# Altium schematic sheet Sheet4.SchDoc
size A3
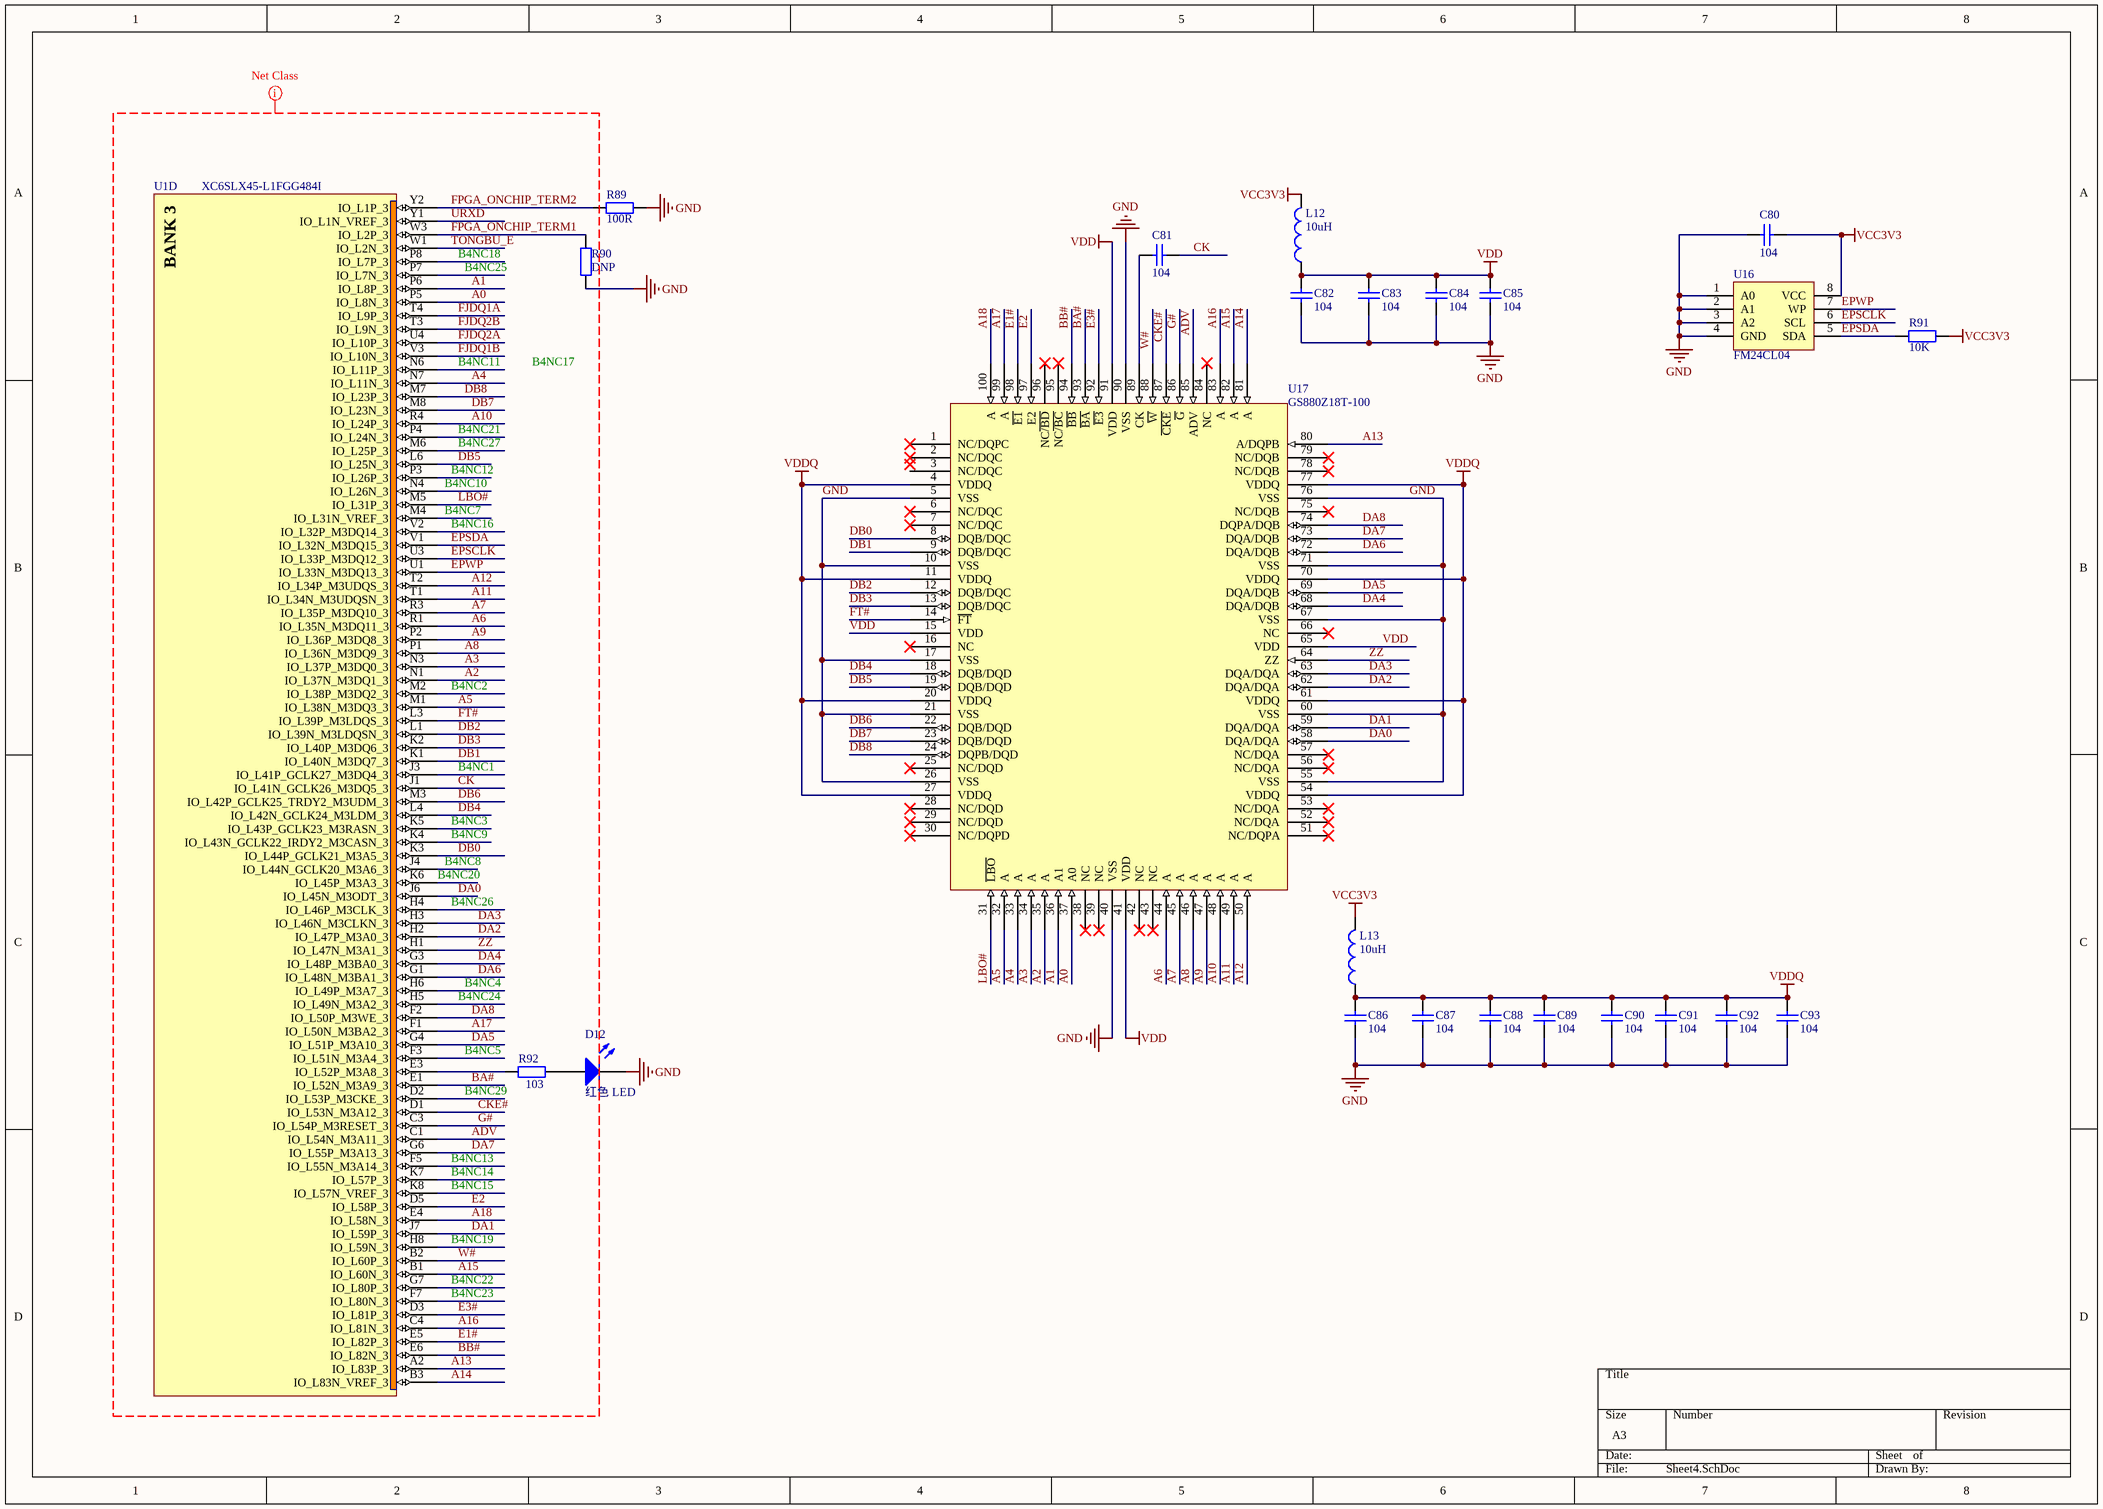
[diagram p0: Sheet4.SchDoc]

## Parts
C80  104  [0402]
C81  104  [0402]
C82  104  [0402]
C83  104  [0402]
C84  104  [0402]
C85  104  [0402]
C86  104  [0402]
C87  104  [0402]
C88  104  [0402]
C89  104  [0402]
C90  104  [0402]
C91  104  [0402]
C92  104  [0402]
C93  104  [0402]
D12  红色 LED  [0805LED]
L12  10uH  [1206A]
L13  10uH  [1206A]
R89  100R  [0603]
R90  DNP  [0603]
R91  10K  [0603]
R92  103  [0603]
U1  XC6SLX45-L1FGG484I  [FGG484]  (part D of 8)
U16  FM24CL04  [so_8]
U17  GS880Z18T-100  [QFP65P1680X2280-100N]

## Nets
GND: C80.2 C82.1 C83.1 C84.1 C85.1 C86.1 C87.1 C88.1 C89.1 C90.1 C91.1 C92.1 C93.1 D12.2(K) R89.2 R90.2 U16.1(A0) U16.2(A1) U16.3(A2) U16.4(GND) U17.5(VSS) U17.10(VSS) U17.17(VSS) U17.21(VSS) U17.26(VSS) U17.40(VSS) U17.55(VSS) U17.60(VSS) U17.67(VSS) U17.71(VSS) U17.76(VSS) U17.90(VSS)
VCC3V3: C80.1 L12.2 L13.2 R91.2 U16.8(VCC)
VDD: C82.2 C83.2 C84.2 C85.2 L12.1 U17.15(VDD) U17.41(VDD) U17.65(VDD) U17.91(VDD)
VDDQ: C86.2 C87.2 C88.2 C89.2 C90.2 C91.2 C92.2 C93.2 L13.1 U17.4(VDDQ) U17.11(VDDQ) U17.20(VDDQ) U17.27(VDDQ) U17.54(VDDQ) U17.61(VDDQ) U17.70(VDDQ) U17.77(VDDQ)
A0: U1.P5(IO_L8N_3) U17.37(A0)
A1: U1.P6(IO_L8P_3) U17.36(A1)
A2: U1.N1(IO_L37N_M3DQ1_3) U17.35(A)
A3: U1.N3(IO_L37P_M3DQ0_3) U17.34(A)
A4: U1.N7(IO_L11N_3) U17.33(A)
A5: U1.M1(IO_L38N_M3DQ3_3) U17.32(A)
A6: U1.R1(IO_L35N_M3DQ11_3) U17.44(A)
A7: U1.R3(IO_L35P_M3DQ10_3) U17.45(A)
A8: U1.P1(IO_L36N_M3DQ9_3) U17.46(A)
A9: U1.P2(IO_L36P_M3DQ8_3) U17.47(A)
A10: U1.R4(IO_L24P_3) U17.48(A)
A11: U1.T1(IO_L34N_M3UDQSN_3) U17.49(A)
A12: U1.T2(IO_L34P_M3UDQS_3) U17.50(A)
A13: U1.A2(IO_L83P_3) U17.80(A/DQPB)
A14: U1.B3(IO_L83N_VREF_3) U17.81(A)
A15: U1.B1(IO_L60N_3) U17.82(A)
A16: U1.C4(IO_L81N_3) U17.83(A)
A17: U1.F1(IO_L50N_M3BA2_3) U17.99(A)
A18: U1.E4(IO_L58N_3) U17.100(A)
ADV: U1.C1(IO_L54N_M3A11_3) U17.85(ADV)
B4NC1: U1.J3(IO_L41P_GCLK27_M3DQ4_3)
B4NC2: U1.M2(IO_L38P_M3DQ2_3)
B4NC3: U1.K5(IO_L43P_GCLK23_M3RASN_3)
B4NC4: U1.H6(IO_L49P_M3A7_3)
B4NC5: U1.F3(IO_L51N_M3A4_3)
B4NC7: U1.M4(IO_L31N_VREF_3)
B4NC8: U1.J4(IO_L44N_GCLK20_M3A6_3)
B4NC9: U1.K4(IO_L43N_GCLK22_IRDY2_M3CASN_3)
B4NC10: U1.N4(IO_L26N_3)
B4NC11: U1.N6(IO_L11P_3)
B4NC12: U1.P3(IO_L26P_3)
B4NC13: U1.F5(IO_L55N_M3A14_3)
B4NC14: U1.K7(IO_L57P_3)
B4NC15: U1.K8(IO_L57N_VREF_3)
B4NC16: U1.V2(IO_L32P_M3DQ14_3)
B4NC18: U1.P8(IO_L7P_3)
B4NC19: U1.H8(IO_L59N_3)
B4NC20: U1.K6(IO_L45P_M3A3_3)
B4NC21: U1.P4(IO_L24N_3)
B4NC22: U1.G7(IO_L80P_3)
B4NC23: U1.F7(IO_L80N_3)
B4NC24: U1.H5(IO_L49N_M3A2_3)
B4NC25: U1.P7(IO_L7N_3)
B4NC26: U1.H4(IO_L46P_M3CLK_3)
B4NC27: U1.M6(IO_L25P_3)
B4NC29: U1.D2(IO_L53P_M3CKE_3)
BA#: U1.E1(IO_L52N_M3A9_3) U17.93(~{BA})
BB#: U1.E6(IO_L82N_3) U17.94(~{BB})
CK: C81.1 U1.J1(IO_L41N_GCLK26_M3DQ5_3)
CKE#: U1.D1(IO_L53N_M3A12_3) U17.87(~{CKE})
DA0: U1.J6(IO_L45N_M3ODT_3) U17.58(DQA/DQA)
DA1: U1.J7(IO_L59P_3) U17.59(DQA/DQA)
DA2: U1.H2(IO_L47P_M3A0_3) U17.62(DQA/DQA)
DA3: U1.H3(IO_L46N_M3CLKN_3) U17.63(DQA/DQA)
DA4: U1.G3(IO_L48P_M3BA0_3) U17.68(DQA/DQB)
DA5: U1.G4(IO_L51P_M3A10_3) U17.69(DQA/DQB)
DA6: U1.G1(IO_L48N_M3BA1_3) U17.72(DQA/DQB)
DA7: U1.G6(IO_L55P_M3A13_3) U17.73(DQA/DQB)
DA8: U1.F2(IO_L50P_M3WE_3) U17.74(DQPA/DQB)
DB0: U1.K3(IO_L44P_GCLK21_M3A5_3) U17.8(DQB/DQC)
DB1: U1.K1(IO_L40N_M3DQ7_3) U17.9(DQB/DQC)
DB2: U1.L1(IO_L39N_M3LDQSN_3) U17.12(DQB/DQC)
DB3: U1.K2(IO_L40P_M3DQ6_3) U17.13(DQB/DQC)
DB4: U1.L4(IO_L42N_GCLK24_M3LDM_3) U17.18(DQB/DQD)
DB5: U1.L6(IO_L25N_3) U17.19(DQB/DQD)
DB6: U1.M3(IO_L42P_GCLK25_TRDY2_M3UDM_3) U17.22(DQB/DQD)
DB7: U1.M8(IO_L23N_3) U17.23(DQB/DQD)
DB8: U1.M7(IO_L23P_3) U17.24(DQPB/DQD)
E1#: U1.E5(IO_L82P_3) U17.98(~{E1})
E2: U1.D5(IO_L58P_3) U17.97(E2)
E3#: U1.D3(IO_L81P_3) U17.92(~{E3})
EPSCLK: U1.U3(IO_L33P_M3DQ12_3) U16.6(SCL)
EPSDA: R91.1 U1.V1(IO_L32N_M3DQ15_3) U16.5(SDA)
EPWP: U1.U1(IO_L33N_M3DQ13_3) U16.7(WP)
FJDQ1A: U1.T4(IO_L9P_3)
FJDQ1B: U1.V3(IO_L10N_3)
FJDQ2A: U1.U4(IO_L10P_3)
FJDQ2B: U1.T3(IO_L9N_3)
FPGA_ONCHIP_TERM1: R90.1 U1.W3(IO_L2P_3)
FPGA_ONCHIP_TERM2: R89.1 U1.Y2(IO_L1P_3)
FT#: U1.L3(IO_L39P_M3LDQS_3) U17.14(~{FT})
G#: U1.C3(IO_L54P_M3RESET_3) U17.86(~{G})
LBO#: U1.M5(IO_L31P_3) U17.31(~{LBO})
TONGBU_E: U1.W1(IO_L2N_3)
URXD: U1.Y1(IO_L1N_VREF_3)
W#: U1.B2(IO_L60P_3) U17.88(~{W})
ZZ: U1.H1(IO_L47N_M3A1_3) U17.64(ZZ)
NetC81_2: C81.2 U17.89(CK)
NetD12_1: D12.1(A) R92.2
NetR92_1: R92.1 U1.E3(IO_L52P_M3A8_3)

Not connected (* = marked no-connect by the designer): U17 1(NC/DQPC)* 2(NC/DQC)* 3(NC/DQC) 6(NC/DQC)* 7(NC/DQC)* 16(NC)* 25(NC/DQD)* 28(NC/DQD)* 29(NC/DQD)* 30(NC/DQPD)* 38(NC)* 39(NC)* 42(NC)* 43(NC)* 51(NC/DQPA)* 52(NC/DQA)* 53(NC/DQA)* 56(NC/DQA)* 57(NC/DQA)* 66(NC)* 75(NC/DQB)* 78(NC/DQB)* 79(NC/DQB)* 84(NC)* 95(NC~{/BC})* 96(NC~{/BD})*

## Layout directives
net class BNAK3: A0, A1, A2, A3, A4, A5, A6, A7, A8, A9, A10, A11, A12, A13, A14, A15, A16, A17, A18, ADV, B4NC1, B4NC2, B4NC3, B4NC4, B4NC5, B4NC7, B4NC8, B4NC9, B4NC10, B4NC11, B4NC12, B4NC13, B4NC14, B4NC15, B4NC16, B4NC17, B4NC18, B4NC19, B4NC20, B4NC21, B4NC22, B4NC23, B4NC24, B4NC25, B4NC26, B4NC27, B4NC29, BA#, BB#, CK, CKE#, DA0, DA1, DA2, DA3, DA4, DA5, DA6, DA7, DA8, DB0, DB1, DB2, DB3, DB4, DB5, DB6, DB7, DB8, E1#, E2, E3#, EPSCLK, EPSDA, EPWP, FJDQ1A, FJDQ1B, FJDQ2A, FJDQ2B, FPGA_ONCHIP_TERM1, FPGA_ONCHIP_TERM2, FT#, G#, LBO#, TONGBU_E, URXD, W#, ZZ

## Notes on the sheet
- Labels drawn without touching a wire or pin: B4NC17
- (in symbol XC6SLX45-L1FGG484I, part D) BANK 3

## Library data of the parts
C80-C93 = Cap: Capacitor; Published: 8-Jun-2000; LatestRevisionDate: 17-Jul-2002; LatestRevisionNote: Re-released for DXP Platform.; Publisher: Altium Limited; Value: 104
  C80 C81: PackageReference: RAD-0.3
  C82-C93: PackageReference: 0805
D12 = LED0: Typical INFRARED GaAs LED; Published: 8-Jun-2000; LatestRevisionDate: 08-Jul-2005; LatestRevisionNote: Mech Layer 1 removed.; PackageReference: LED-0; Publisher: Altium Limited
L12 L13 = Inductor: Code_IEC: 1005; Published: 8-Jun-2000; LatestRevisionDate: 29-May-2009; LatestRevisionNote: IPC-7351 Footprint Added.; PackageReference: 0402-A; Publisher: Altium Limited; PackageDescription: Chip Inductor; Code_JEITA: 0402; Value: 10uH
R89 R90 = Res2: Resistor; Published: 8-Jun-2000; LatestRevisionDate: 17-Jul-2002; LatestRevisionNote: Re-released for DXP Platform.; PackageReference: AXIAL-0.4; Publisher: Altium Limited
  R89: Value: 100R
  R90: Value: DNP
R91 = Resistor
R92 = Res2: Resistor; Value: 10K; Published: 8-Jun-2000; LatestRevisionDate: 17-Jul-2002; LatestRevisionNote: Re-released for DXP Platform.; PackageReference: AXIAL-0.4; Publisher: Altium Limited
U1 = XC6SLX45-L1FGG484I: Spartan-6 LX 1.0V FPGA, 316 User I/Os, 484-Ball Fine-Pitch BGA (1.0mm Pitch), Low Power Version, Industrial Grade, Pb-Free; FirstPublished: 17-Nov-2009; DatasheetVersion: ver1.3, Nov-2009; PackageVersion: ver1.1, Dec-2008; PackageReference: FGG484; Publisher: Altium Limited; PackageDescription: 484-Ball Fine Pitch Ball Grid Array 1.00 mm Pitch (FGG484) - Pb-Free; Code_JEDEC: MS-034-AAJ-1; Code_IPC: BGA100P22X22-484; ComponentLink1Description: Spartan-6 Datasheet; ComponentLink1URL: http://www.xilinx.com/support/documentation/data_sheets/ds160.pdf; ComponentLink2Description: Pinout Specification; ComponentLink2URL: http://www.xilinx.com/support/documentation/user_guides/ug385.pdf; ComponentLink3Description: FGG484 Package Drawing; ComponentLink3URL: http://www.xilinx.com/support/documentation/package_specs/fg484.pdf; ComponentLink4Description: Spartan-6 Documents; ComponentLink4URL: http://www.xilinx.com/support/documentation/spartan-6.htm; ComponentLink5Description: Xilinx.com Home; ComponentLink5URL: http://www.xilinx.com
U17 = GS880Z18BT100